# EAGLE design SmartHomeControllerCircuit (EAGLE 7.5.0)
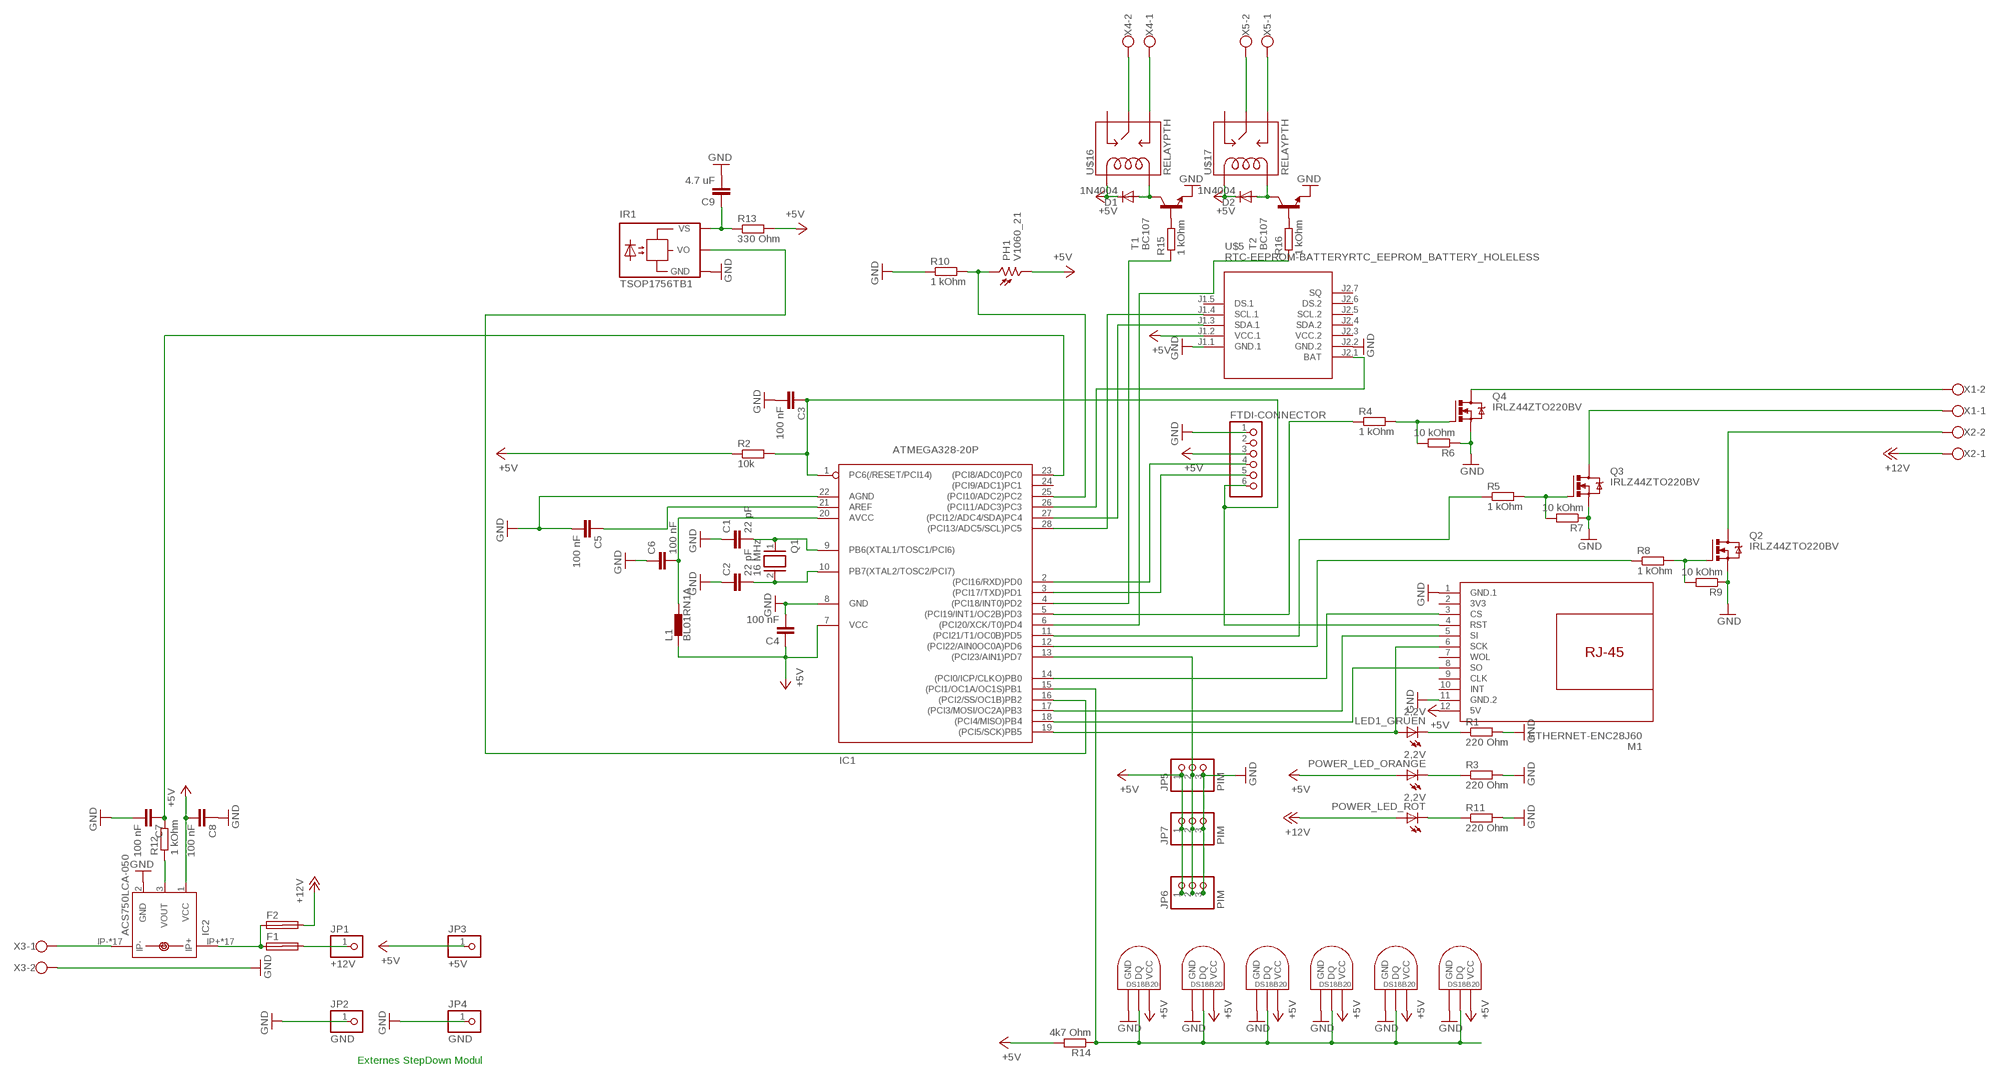
[diagram p0: schematic, sheet 1]

## Parts
C1  22 pF  C-EU050-024X044  [C050-024X044]
C2  22 pF  C-EU050-024X044  [C050-024X044]
C3  100 nF  C-EU050-024X044  [C050-024X044]
C4  100 nF  C-EU050-024X044  [C050-024X044]
C5  100 nF  C-EU050-024X044  [C050-024X044]
C6  100 nF  C-EU050-024X044  [C050-024X044]
C7  100 nF  C-EU050-024X044  [C050-024X044]
C8  100 nF  C-EU050-024X044  [C050-024X044]
C9  4.7 uF  C-EU050-024X044  [C050-024X044]
D1  1N4004  [DO41-10]
D2  1N4004  [DO41-10]
F1  SH32  [SH32]
F2  SH32  [SH32]
FTDI-CONNECTOR  PINHD-1X6  [1X06]
IC1  ATMEGA328-20P  [DIL28-3]
IC2  ACS750LCA-050  [ACS75050]
IR1  TSOP1756TB1  [TSOP17_TB1]
JP1  +12V  PINHD-1X1  [1X01]
JP2  GND  PINHD-1X1  [1X01]
JP3  +5V  PINHD-1X1  [1X01]
JP4  GND  PINHD-1X1  [1X01]
JP5  PIM  PINHD-1X3  [1X03]
JP6  PIM  PINHD-1X3  [1X03]
JP7  PIM  PINHD-1X3  [1X03]
L1  BL01RN1A  [BL01RN1A]
LED1_GRUEN  2,2V  LED5MM  [LED5MM]
M1  ETHERNET-ENC28J60  [ETHERNET-ENC28J60]
PH1  V1060_21  [TO-5_V10]
POWER_LED_ORANGE  2,2V  LED5MM  [LED5MM]
POWER_LED_ROT  2,2V  LED5MM  [LED5MM]
Q1  16 MHz  XTAL/S  [QS]
Q2  IRLZ44ZTO220BV  [TO220BV]
Q3  IRLZ44ZTO220BV  [TO220BV]
Q4  IRLZ44ZTO220BV  [TO220BV]
R1  220 Ohm  R-EU_0204/7  [0204/7]
R2  10k  R-EU_0204/7  [0204/7]
R3  220 Ohm  R-EU_0204/7  [0204/7]
R4  1 kOhm  R-EU_0309/12  [0309/12]
R5  1 kOhm  R-EU_0309/12  [0309/12]
R6  10 kOhm  R-EU_0309/12  [0309/12]
R7  10 kOhm  R-EU_0309/12  [0309/12]
R8  1 kOhm  R-EU_0309/12  [0309/12]
R9  10 kOhm  R-EU_0309/12  [0309/12]
R10  1 kOhm  R-EU_0309/12  [0309/12]
R11  220 Ohm  R-EU_0204/7  [0204/7]
R12  1 kOhm  R-EU_0204/7  [0204/7]
R13  330 Ohm  R-EU_0309/12  [0309/12]
R14  4k7 Ohm  R-EU_0204/7  [0204/7]
R15  1 kOhm  R-EU_0309/12  [0309/12]
R16  1 kOhm  R-EU_0309/12  [0309/12]
T1  BC107  [TO18]
T2  BC107  [TO18]
U$5  RTC-EEPROM-BATTERYRTC_EEPROM_BATTERY_HOLELESS  [RTC_EEPROM_BATTERY]
U$10  DS1820TO92  [DS1820]
U$11  DS1820TO92  [DS1820]
U$12  DS1820TO92  [DS1820]
U$13  DS1820TO92  [DS1820]
U$14  DS1820TO92  [DS1820]
U$15  DS1820TO92  [DS1820]
U$16  RELAYPTH  [SRD-05VDC-SL-C]
U$17  RELAYPTH  [SRD-05VDC-SL-C]
X1  W237-102  [W237-102]
X2  W237-102  [W237-102]
X3  W237-102  [W237-102]
X4  W237-102  [W237-102]
X5  W237-102  [W237-102]

## Nets
+5V: C4.1 C8.2 D1.C D2.C FTDI-CONNECTOR.3 IC1.7(VCC) IC2.1(VCC) JP3.1 JP5.1 JP6.1 JP7.1 L1.1 M1.12(5V) PH1.2 POWER_LED_ORANGE.A R2.1 R13.2 R14.2 U$5.J1.2(VCC.1) U$10.VDD(VCC) U$11.VDD(VCC) U$12.VDD(VCC) U$13.VDD(VCC) U$14.VDD(VCC) U$15.VDD(VCC) U$16.COIL1 U$17.COIL1
+12V: F2.2A POWER_LED_ROT.A X2.1
+12V_IN: F1.1A F2.1A IC2.IP+ IC2.IP+@2(IP+) IC2.IP+@3(IP+) IC2.IP+@4(IP+) IC2.IP+@5(IP+) IC2.IP+@6(IP+) IC2.IP+@7(IP+) IC2.IP+@8(IP+) IC2.IP+@9(IP+) IC2.IP+@10(IP+) IC2.IP+@11(IP+) IC2.IP+@12(IP+) IC2.IP+@13(IP+) IC2.IP+@14(IP+) IC2.IP+@15(IP+) IC2.IP+@16(IP+) IC2.IP+@17(IP+) IC2.IP- IC2.IP-@2(IP-) IC2.IP-@3(IP-) IC2.IP-@4(IP-) IC2.IP-@5(IP-) IC2.IP-@6(IP-) IC2.IP-@7(IP-) IC2.IP-@8(IP-) IC2.IP-@9(IP-) IC2.IP-@10(IP-) IC2.IP-@11(IP-) IC2.IP-@12(IP-) IC2.IP-@13(IP-) IC2.IP-@14(IP-) IC2.IP-@15(IP-) IC2.IP-@16(IP-) IC2.IP-@17(IP-) X3.1
GND: C1.1 C2.1 C3.2 C4.2 C5.2 C6.1 C7.2 C8.1 C9.2 FTDI-CONNECTOR.1 IC1.8(GND) IC1.22(AGND) IC2.2(GND) IR1.GND JP2.1 JP4.1 JP5.3 JP6.3 JP7.3 M1.1(GND.1) M1.11(GND.2) Q2.S Q3.S Q4.S R1.2 R3.2 R6.1 R7.1 R9.1 R10.1 R11.2 T1.1(E) T2.1(E) U$5.J1.1(GND.1) U$5.J2.2(GND.2) U$10.GND U$11.GND U$12.GND U$13.GND U$14.GND U$15.GND X3.2
N$1: C2.2 IC1.10(PB7(XTAL2/TOSC2/PCI7)) Q1.2
N$2: C1.2 IC1.9(PB6(XTAL1/TOSC1/PCI6)) Q1.1
N$3: C3.1 FTDI-CONNECTOR.6 IC1.1(PC6(/RESET/PCI14)) M1.4(RST) R2.2
N$4: FTDI-CONNECTOR.4 IC1.2((PCI16/RXD)PD0)
N$5: FTDI-CONNECTOR.5 IC1.3((PCI17/TXD)PD1)
N$7: IC1.19((PCI5/SCK)PB5) LED1_GRUEN.A M1.6(SCK)
N$8: LED1_GRUEN.K(C) R1.1
N$9: POWER_LED_ORANGE.K(C) R3.1
N$10: F1.2A JP1.1
N$12: IC1.25((PCI10/ADC2)PC2) PH1.1 R10.2
N$13: C9.1 IR1.VS R13.1
N$14: IC1.28((PCI13/ADC5/SCL)PC5) U$5.J1.4(SCL.1)
N$15: IC1.27((PCI12/ADC4/SDA)PC4) U$5.J1.3(SDA.1)
N$16: IC1.14((PCI0/ICP/CLKO)PB0) M1.3(CS)
N$17: IC1.18((PCI4/MISO)PB4) M1.8(SO)
N$18: IC1.17((PCI3/MOSI/OC2A)PB3) M1.5(SI)
N$19: Q2.D X2.2
N$20: Q2.G R8.2 R9.2
N$21: Q3.D X1.1
N$22: Q4.D X1.2
N$23: Q3.G R5.2 R7.2
N$24: Q4.G R4.2 R6.2
N$25: IC1.5((PCI19/INT1/OC2B)PD3) R4.1
N$26: IC1.11((PCI21/T1/OC0B)PD5) R5.1
N$27: IC1.15((PCI1/OC1A/OC1S)PB1) R14.1 U$10.DQ U$11.DQ U$12.DQ U$13.DQ U$14.DQ U$15.DQ
N$28: C7.1 IC1.23((PCI8/ADC0)PC0) R12.2
N$29: IC1.13((PCI23/AIN1)PD7) JP5.2 JP6.2 JP7.2
N$30: POWER_LED_ROT.K(C) R11.1
N$31: IC2.3(VOUT) R12.1
N$32: IC1.16((PCI2/SS/OC1B)PB2) IR1.VO
N$33: IC1.12((PCI22/AIN0OC0A)PD6) R8.1
N$34: U$16.SWCOMMON X4.2
N$35: IC1.26((PCI11/ADC3)PC3) U$5.J2.1(BAT)
N$36: U$16.SWOPEN X4.1
N$37: U$17.SWCOMMON X5.2
N$38: U$17.SWOPEN X5.1
N$39: IC1.4((PCI18/INT0)PD2) R15.1
N$40: IC1.6((PCI20/XCK/T0)PD4) R16.1
N$41: D1.A T1.3(C) U$16.COIL0
N$42: D2.A T2.3(C) U$17.COIL0
N$43: R15.2 T1.2(B)
N$44: R16.2 T2.2(B)
N$46: C5.1 IC1.21(AREF)
N$47: C6.2 IC1.20(AVCC) L1.2
Unconnected: F1.1B F1.2B F2.1B F2.2B FTDI-CONNECTOR.2 IC1.24((PCI9/ADC1)PC1) M1.7(WOL) M1.9(CLK) M1.10(INT) U$5.J1.5(DS.1) U$5.J2.4(SDA.2) U$5.J2.5(SCL.2) U$5.J2.6(DS.2) U$5.J2.7(SQ) U$16.SWCLOSED(SWCLOSE) U$17.SWCLOSED(SWCLOSE)

## Notes on the sheet
- Externes StepDown Modul

## Power pins joined to a net without a drawn wire
3V3: M1.2(3V3)
VCC.2: U$5.J2.3(VCC.2)

## Library data of the parts
C1-C9 = rcl:C-EU: CAPACITOR, European symbol
D1 D2 = diode:1N4004: DIODE general purpose rectifier, 1 A
F1 F2 = fuse:SH32: FUSE HOLDER 6 x 32 mm, SH contact, SHH3N Schukat, 102071 Wickmann (Buerklin); MPN: 10207101009; OC_FARNELL: 811786; OC_NEWARK: 76R6904
FTDI-CONNECTOR = pinhead:PINHD-1X6: PIN HEADER
IC1 = atmega328:ATMEGA328*P: MICROCONTROLLER 32 kBytes FLASH 2 kBytes SRAM 1 kBytes EEPROM USART 8-channel 10 bit ADC
IC2 = allegro:ACS750*CA-050: Current Sensor display layer 49 Reference in BRD and place VIAs on circles Source: www.allegromicro.com/datafile/0750-050.pdf; MF: ALLEGRO MICROSYSTEMS, INC.; MPN: ACS750LCA-050; OC_FARNELL: 1457176; OC_NEWARK: 61H4464
IR1 = telefunken:TSOP17*TB1: TSOP17..TB1 IR Receiver Modules for Remote Control Systems Source: http://www.vishay.com/docs/82042/82042.pdf; OC_FARNELL: unknown; OC_NEWARK: unknown
JP1-JP4 = pinhead:PINHD-1X1: PIN HEADER
JP5-JP7 = pinhead:PINHD-1X3: PIN HEADER
L1 = inductors:BL0: Noise Suppression Products/EMI Suppression Filters, Lead EMIFIL(R) Inductor Type Source: http://www.murata.com .. BL01RN1_DS.pdf
LED1_GRUEN POWER_LED_ORANGE POWER_LED_ROT = led:LED: LED OSRAM: - CHIPLED LG R971, LG N971, LY N971, LG Q971, LY Q971, LO R971, LY R971 LH N974, LH R974 LS Q976, LO Q976, LY Q976 LO Q996 - Hyper CHIPLED LW Q18S LB Q993, LB Q99A, LB R99A - SideLED LS A670, LO A670, LY A670, LG A670, LP A670 LB A673, LV A673, LT A673, LW A673 LH A674 LY A675 LS A676, LA A676, LO A676, LY A676, LW A676 LS A679, LY A679, LG A679 - Hyper Micro SIDELED® LS Y876, LA Y876, LO Y876, LY Y876 LT Y87S - SmartLED LW L88C, LW L88S LB L89C, LB L89S, LG L890 LS L89K, LO L89K, LY L89K LS L896, LA L896, LO L896, LY L896 - TOPLED LS T670, LO T670, LY T670, LG T670, LP T670 LSG T670, LSP T670, LSY T670, LOP T670, LYG T670 LG T671, LOG T671, LSG T671 LB T673, LV T673, LT T673, LW T673 LH T674 LS T676, LA T676, LO T676, LY T676, LB T676, LH T676, LSB T676, LW T676 LB T67C, LV T67C, LT T67C, LS T67K, LO T67K, LY T67K, LW E67C LS E67B, LA E67B, LO E67B, LY E67B, LB E67C, LV E67C, LT E67C LW T67C LS T679, LY T679, LG T679 LS T770, LO T770, LY T770, LG T770, LP T770 LB T773, LV T773, LT T773, LW T773 LH T774 LS E675, LA E675, LY E675, LS T675 LS T776, LA T776, LO T776, LY T776, LB T776 LHGB T686 LT T68C, LB T68C - Hyper Mini TOPLED® LB M676 - Mini TOPLED Santana® LG M470 LS M47K, LO M47K, LY M47K Source: http://www.osram.convergy.de LUXEON: - LUMILED® LXK2-PW12-R00, LXK2-PW12-S00, LXK2-PW14-U00, LXK2-PW14-V00 LXK2-PM12-R00, LXK2-PM12-S00, LXK2-PM14-U00 LXK2-PE12-Q00, LXK2-PE12-R00, LXK2-PE12-S00, LXK2-PE14-T00, LXK2-PE14-U00 LXK2-PB12-K00, LXK2-PB12-L00, LXK2-PB12-M00, LXK2-PB14-N00, LXK2-PB14-P00, LXK2-PB14-Q00 LXK2-PR12-L00, LXK2-PR12-M00, LXK2-PR14-Q00, LXK2-PR14-R00 LXK2-PD12-Q00, LXK2-PD12-R00, LXK2-PD12-S00 LXK2-PH12-R00, LXK2-PH12-S00 LXK2-PL12-P00, LXK2-PL12-Q00, LXK2-PL12-R00 Source: www.luxeon.com KINGBRIGHT: KA-3528ASYC Source: www.kingbright.com
M1 = diy-modules:ETHERNET-ENC28J60: Ethernet Module based on ENC28J60 chip
PH1 = photo-elements:?1060*: Sensor Street Light control Source: http://optoelectronics.perkinelmer.com/content/Datasheets/DTS_PhotocellsB1060.pdf
Q1 = special:XTAL/S: CRYSTAL
Q2-Q4 = transistor-power:IRLZ44Z: N-Channel HEXFET® Power MOSFET Logic Level AUTOMOTIVE MOSFET Source: http://www.irf.com/product-info/datasheets/data/irlz44zpbf.pdf
R1-R3 R11 R12 R14 = resistor:R-EU_: RESISTOR, European symbol
R4-R10 R13 R15 R16 = rcl:R-EU_: RESISTOR, European symbol
T1 T2 = transistor:BC107: NPN TRANSISTOR
U$5 = diy-modules:RTC-EEPROM-BATTERY: RTC Module with Battery and EEPROM based on DS1307 and AT24C32 chips
U$10-U$15 = Ava:DS1820: DS18B20 Programmable Resolution 1-Wire Digital Thermometer Description The DS18B20 digital thermometer provides 9-bit to 12-bit Celsius temperature measurements and has an alarm function with nonvolatile user-programmable upper and lower trigger points. The DS18B20 communicates over a 1-Wire® bus that by definition requires only one data line (and ground) for communication with a central microprocessor. It has an operating temperature range of -55°C to +125°C and is accurate to ±0.5°C over the range of -10°C to +85°C. In addition, the DS18B20 can derive power directly from the data line ("parasite power"), eliminating the need for an external power supply. Each DS18B20 has a unique 64-bit serial code, which allows multiple DS18B20s to function on the same 1-Wire bus. Thus, it is simple to use one microprocessor to control many DS18B20s distributed over a large area. Applications that can benefit from this feature include HVAC environmental controls, temperature monitoring systems inside buildings, equipment, or machinery, and process monitoring and control systems.
U$16 U$17 = SRD-05VDC-SL-C:RELAY: SPDT relay (COM-00101)
X1-X5 = con-wago-500:W237-102: WAGO SCREW CLAMP; MPN: 237-102; OC_FARNELL: unknown; OC_NEWARK: 70K9898

## Board
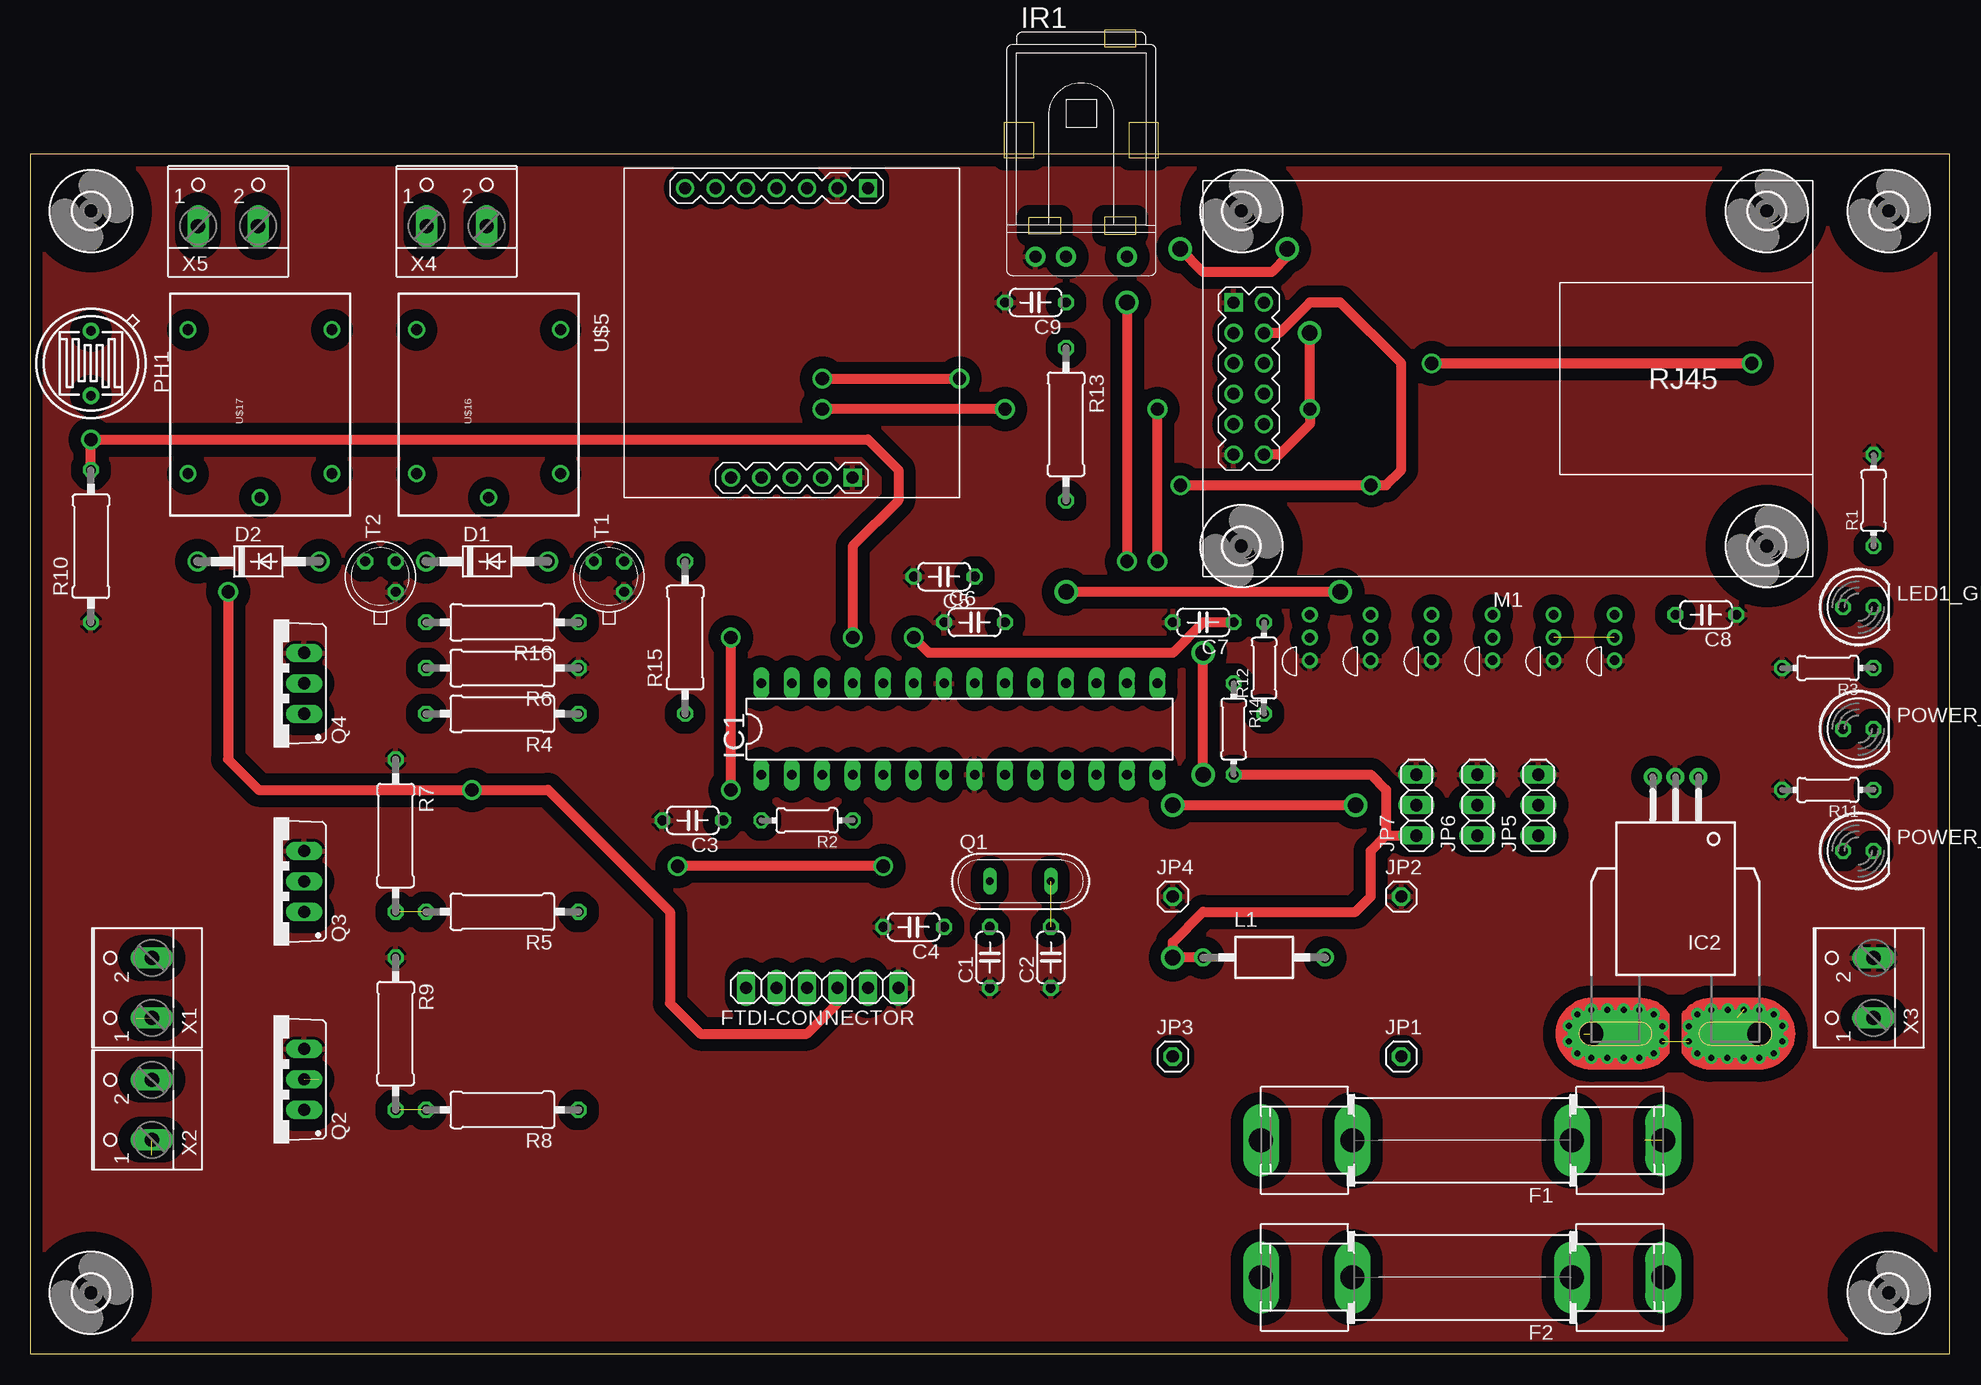
[diagram p1: board, top side]
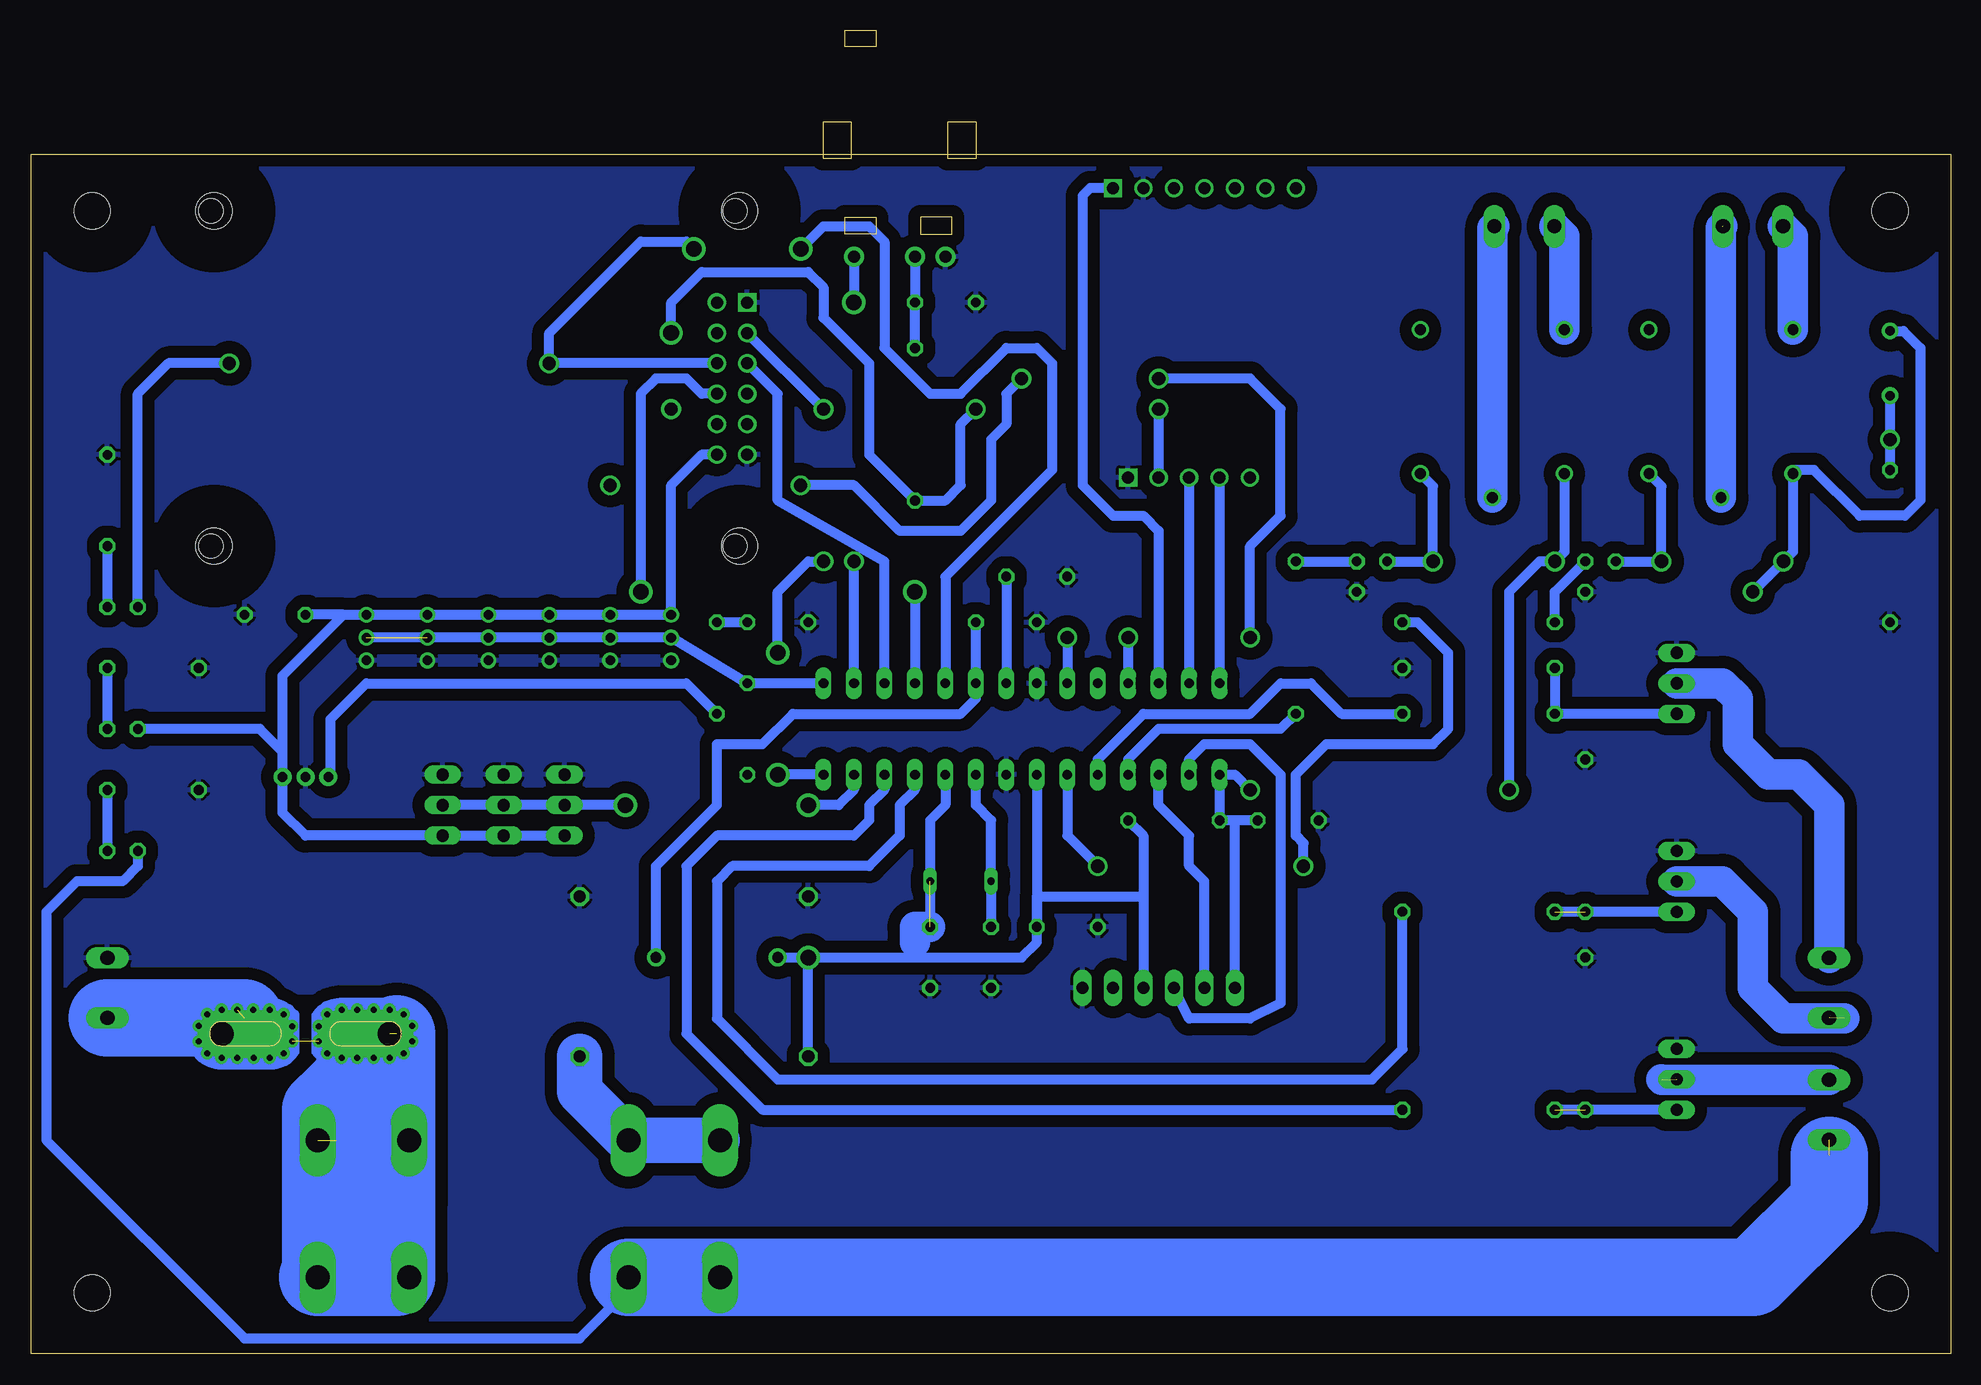
[diagram p2: board, bottom side, seen from below]

Size 160 x 100 mm. Coordinates in mm from the lower left corner, seen from the top.
Outline: 0,0 160,0 160,100 0,100 0,0
Copper layers (1*16): Top 0.035mm / dielectric 1.5mm / Bottom 0.035mm
Design rules "default": minimum track width 10mil, minimum drill 24mil, track to track 8mil, track to pad 8mil, pad to pad 8mil, via to via 8mil, smd to smd 8mil, copper to edge 40mil, drill to drill 8mil, minimum pad ring 10mil, minimum via ring 8mil, stop-mask expansion 4mil, vias tented up to drill 0mil, thermal gap 10mil

### Footprints (pad centres in the part's own frame; a part is rotated, then mirrored left to right if it is on the bottom)
C050-024X044 = drill 0.813 octagon: 1 -2.54,0; 2 2.54,0
DO41-10 = drill 1.118: A 5.08,0; C -5.08,0
SH32 = drill 2.007 long: 1A -16.764,0; 1B -9.144,0; 2A 9.144,0; 2B 16.764,0
1X06 = drill 1.016 long: 1 -6.35,0; 2 -3.81,0; 3 -1.27,0; 4 1.27,0; 5 3.81,0; 6 6.35,0
DIL28-3 = drill 0.813 long: 1 -16.51,-3.81; 2 -13.97,-3.81; 3 -11.43,-3.81; 4 -8.89,-3.81; 5 -6.35,-3.81; 6 -3.81,-3.81; 7 -1.27,-3.81; 8 1.27,-3.81; 9 3.81,-3.81; 10 6.35,-3.81; 11 8.89,-3.81; 12 11.43,-3.81; 13 13.97,-3.81; 14 16.51,-3.81; 15 16.51,3.81; 16 13.97,3.81; 17 11.43,3.81; 18 8.89,3.81; 19 6.35,3.81; 20 3.81,3.81; 21 1.27,3.81; 22 -1.27,3.81; 23 -3.81,3.81; 24 -6.35,3.81; 25 -8.89,3.81; 26 -11.43,3.81; 27 -13.97,3.81; 28 -16.51,3.81
ACS75050 = drill 0.8 pad 1.5: 1 -1.91,-21.4; 2 0,-21.4; 3 1.91,-21.4 | drill 2 pad 4 offset: IP+ 7,0; IP- -7,0 | drill 0.5 pad 0.9: IP+@2 8.89,-0.635; IP+@3 8.89,0.635; IP+@4 8.175,1.625; IP+@5 7,2; IP+@6 5.675,2; IP+@7 4.325,2; IP+@8 3,2; IP+@9 1.825,1.625; IP+@10 1.1,0.625; IP+@11 1.1,-0.625; IP+@12 1.825,-1.625; IP+@13 3,-2; IP+@14 4.325,-2; IP+@15 5.675,-2; IP+@16 7,-2; IP+@17 8.175,-1.625; IP-@2 -8.89,-0.635; IP-@3 -8.89,0.635; IP-@4 -8.175,1.625; IP-@5 -7,2; IP-@6 -5.675,2; IP-@7 -4.325,2; IP-@8 -3,2; IP-@9 -1.825,1.625; IP-@10 -1.1,0.625; IP-@11 -1.1,-0.625; IP-@12 -1.825,-1.625; IP-@13 -3,-2; IP-@14 -4.35,-2; IP-@15 -5.675,-2; IP-@16 -7,-2; IP-@17 -8.175,-1.625
TSOP17_TB1 = drill 1 pad 1.676: GND 0,-3.81; VO 0,3.81; VS 0,-1.27
1X01 = drill 1.016 octagon: 1 0,0
1X03 = drill 1.016 long: 1 -2.54,0; 2 0,0; 3 2.54,0
BL01RN1A = drill 0.9 pad 1.5: 1 -5.08,0; 2 5.08,0
LED5MM = drill 0.813 octagon: A -1.27,0; K 1.27,0
ETHERNET-ENC28J60 = drill 1 square: 1 22.86,-6.35 | drill 1: 2 20.32,-6.35; 3 22.86,-3.81; 4 20.32,-3.81; 5 22.86,-1.27; 6 20.32,-1.27; 7 22.86,1.27; 8 20.32,1.27; 9 22.86,3.81; 10 20.32,3.81; 11 22.86,6.35; 12 20.32,6.35 | hole 2: -21.844,13.97; 21.844,13.97; -21.844,-13.97; 21.844,-13.97
TO-5_V10 = drill 0.8 pad 1.4: 1 -2.7,0; 2 2.7,0
QS = drill 0.61 long: 1 -2.54,0; 2 2.54,0
TO220BV = drill 1.016 long: D 0,-2.54; G -2.54,-2.54; S 2.54,-2.54
0204/7 = drill 0.813 octagon: 1 -3.81,0; 2 3.81,0
0309/12 = drill 0.813 octagon: 1 -6.35,0; 2 6.35,0
TO18 = drill 0.813 octagon: 1 -1.27,-1.27; 2 1.27,-1.27; 3 1.27,1.27
3,0 = hole 3: 0,0
RTC_EEPROM_BATTERY = drill 1 square: J1.1 -12.065,-5.08; J2.1 12.065,-6.35 | drill 1: J1.2 -12.065,-2.54; J1.3 -12.065,0; J1.4 -12.065,2.54; J1.5 -12.065,5.08; J2.2 12.065,-3.81; J2.3 12.065,-1.27; J2.4 12.065,1.27; J2.5 12.065,3.81; J2.6 12.065,6.35; J2.7 12.065,8.89
DS1820 = drill 0.8: DQ 2.54,-1.27; GND 0.635,-1.27; VDD 4.445,-1.27
SRD-05VDC-SL-C = drill 0.9: COIL0 -5.39,-6.12; COIL1 -5.39,5.88; SWCLOSED 6.61,-6.12; SWCOMMON -7.39,-0.12; SWOPEN 6.61,5.88
W237-102 = drill 1.194 long: 1 -2.5,-1.27; 2 2.5,-1.27

### Placement (x,y rotation side)
C1  80.01,33.02 90 top
C2  85.09,33.02 90 top
C3  55.24,44.45 180 top
C4  73.66,35.56 180 top
C5  76.2,64.77 180 top
C6  78.74,60.96 0 top
C7  97.79,60.96 180 top
C8  139.7,61.59 180 top
C9  83.82,87.63 180 top
D1  38.1,66.04 0 top
D2  19.05,66.04 0 top
F1  119.38,17.78 180 top
F2  119.38,6.35 180 top
FTDI-CONNECTOR  66.04,30.48 180 top
IC1  77.47,52.07 0 top
IC2  137.16,26.67 180 top
IR1  87.63,91.44 270 top
JP1  114.3,24.77 0 top
JP2  114.3,38.1 0 top
JP3  95.25,24.77 0 top
JP4  95.25,38.1 0 top
JP5  125.73,45.72 90 top
JP6  120.65,45.72 90 top
JP7  115.57,45.72 90 top
L1  102.87,33.02 0 top
LED1_GRUEN  152.4,62.23 0 top
M1  123.19,81.28 180 top
PH1  5.08,82.55 90 top
POWER_LED_ORANGE  152.4,52.07 0 top
POWER_LED_ROT  152.4,41.91 0 top
Q1  82.55,39.37 0 top
Q2  20.32,22.86 90 top
Q3  20.32,39.37 90 top
Q4  20.32,55.88 90 top
R1  153.67,71.12 90 top
R2  64.77,44.45 180 top
R3  149.86,57.15 180 top
R4  39.37,53.34 180 top
R5  39.37,36.83 180 top
R6  39.37,57.15 180 top
R7  30.48,43.18 270 top
R8  39.37,20.32 180 top
R9  30.48,26.67 270 top
R10  5.08,67.31 90 top
R11  149.86,46.99 180 top
R12  102.87,57.15 90 top
R13  86.36,77.47 270 top
R14  100.33,52.07 270 top
R15  54.61,59.69 90 top
R16  39.37,60.96 180 top
T1  48.26,64.77 90 top
T2  29.21,64.77 90 top
U$1  [3,0]  5.08,5.08 0 top
U$2  [3,0]  5.08,95.25 0 top
U$3  [3,0]  154.94,95.25 0 top
U$4  [3,0]  154.94,5.08 0 top
U$5  63.5,85.09 90 top
U$6  [3,0]  144.78,67.31 0 top
U$7  [3,0]  144.78,95.25 0 top
U$8  [3,0]  100.97,95.25 0 top
U$9  [3,0]  100.97,67.31 0 top
U$10  105.41,57.15 90 top
U$11  110.49,57.15 90 top
U$12  115.57,57.15 90 top
U$13  120.65,57.15 90 top
U$14  125.73,57.15 90 top
U$15  130.81,57.15 90 top
U$16  38.1,78.74 90 top
U$17  19.05,78.74 90 top
X1  8.89,30.48 90 top
X2  8.89,20.32 90 top
X3  152.4,30.48 90 top
X4  35.56,95.25 0 top
X5  16.51,95.25 0 top

### Tracks (layer width: path | path; a pad name or v marks a point on that pad's centre or on a via)
+5V  (via drill 1.1, 1.3)
  Top 0.813: v16.51,63.5 16.51,49.53 19.05,46.99 v36.83,46.99 43.18,46.99 53.34,36.83 53.34,29.21 55.88,26.67 64.77,26.67 67.31,29.21 FTDI-CONNECTOR.3 | v81.28,78.74 v66.04,78.74 | v106.68,85.09 v106.68,78.74 106.68,77.47 104.14,74.93 M1.12 | L1.1 v95.25,33.02 95.25,34.29 97.79,36.83 110.49,36.83 111.76,38.1 111.76,41.91 113.03,43.18 | 113.03,43.18 JP7.1 | R14.2 111.76,48.26 113.03,46.99 113.03,43.18
  Bottom 0.813: R2.1 67.31,43.18 67.31,38.1 | 67.31,38.1 FTDI-CONNECTOR.3 | JP3.1 v95.25,33.02 | v95.25,33.02 77.47,33.02 76.2,34.29 C4.1 | IC1.7 C4.1 | C4.1 76.2,38.1 67.31,38.1 | IC2.1 139.07,56.51 133.99,61.59 | 133.99,61.59 U$15.VDD U$14.VDD U$13.VDD U$12.VDD U$11.VDD U$10.VDD 106.68,72.39 104.14,74.93 M1.12 | L1.1 v95.25,33.02 | 133.99,61.59 C8.2 | IC2.1 139.06,45.09 137.16,43.18 JP5.1 JP6.1 JP7.1 | IC2.1 139.07,50.17 140.97,52.07 POWER_LED_ORANGE.A | U$16.COIL1 32.22,66.84 D1.C 34.29,66.04 36.83,63.5 v36.83,46.99 | v16.51,63.5 D2.C 13.17,66.84 U$17.COIL1 12.86,73.66 11.43,73.66 7.62,69.85 3.81,69.85 2.54,71.12 2.54,83.82 3.97,85.25 PH1.2 | v81.28,78.74 82.55,77.47 82.55,72.39 83.82,71.12 R13.2 90.17,74.93 90.17,82.55 93.98,86.36 93.98,88.9 95.25,90.17 104.14,90.17 106.68,87.63 v106.68,85.09 | v66.04,78.74 U$5.J1.2
+12V  (1 unrouted)
  Bottom 0.813: POWER_LED_ROT.A 151.13,40.64 152.4,39.37 156.21,39.37 158.75,36.83 158.75,17.78 142.24,1.27 114.3,1.27 109.22,6.35
  Bottom 6.452: F2.2A 109.22,6.35 16.51,6.35 10.16,12.7 10.16,16.51
+12V_IN  (4 unrouted)
  Bottom 6.452: X3.1 142.28,27.98 142.24,27.94 | F2.1A 135.89,6.35 | 135.89,6.35 129.54,6.35 129.54,12.7 | 129.54,12.7 134.62,17.78 134.62,21.59 | 134.62,21.59 133.35,22.86 129.54,26.67 129.54,12.7 | 129.54,12.7 135.89,6.35 | 135.89,6.35 135.89,20.32 134.62,21.59
GND
  pour Bottom (isolate 1.016): 0,100.33 160.02,100.33 160.02,0 0,0
  pour Top (isolate 1.016): 0,100.33 160.02,100.33 160.02,0 0,0
N$1  (1 unrouted)
  Bottom 0.813: IC1.10 83.82,45.72 85.09,44.45 C2.2
  Bottom 2.54: C2.2 86.36,35.56 86.36,34.29
N$2
  Bottom 0.813: IC1.9 81.28,45.72 80.01,44.45 Q1.1 C1.2
N$3  (via drill 1.1)
  Top 0.813: v58.42,46.99 v58.42,59.69 | v66.04,81.28 v77.47,81.28 | v95.89,72.39 v111.76,72.39 113.03,72.39 114.3,73.66 114.3,82.55 109.22,87.63 106.68,87.63 104.14,85.09 M1.4
  Bottom 0.813: C3.1 59.69,44.45 | 59.69,44.45 R2.2 IC1.1 59.69,48.26 v58.42,46.99 | FTDI-CONNECTOR.6 59.69,44.45 | v58.42,59.69 58.42,67.31 55.88,69.85 55.88,78.74 58.42,81.28 v66.04,81.28 | v77.47,81.28 78.74,80.01 78.74,77.47 80.01,76.2 80.01,71.12 82.55,68.58 87.63,68.58 91.44,72.39 v95.89,72.39
N$4
  Bottom 0.813: FTDI-CONNECTOR.4 63.5,27.94 58.42,27.94 55.88,29.21 55.88,48.26 58.42,50.8 62.23,50.8 63.5,49.53 IC1.2
N$5
  Bottom 0.813: FTDI-CONNECTOR.5 62.23,39.37 63.5,40.64 63.5,43.18 66.04,45.72 IC1.3
N$6
  pour Bottom: 0,59.69 0,41.91 2.54,41.91 6.35,45.72 6.35,55.88 2.54,59.69
N$7  (via drill 1.1, 1.3)
  Top 0.813: v116.84,82.55 v143.51,82.55 | v104.78,92.08 104.78,91.44 103.5,90.17 97.79,90.17 v95.89,92.08
  Bottom 0.813: LED1_GRUEN.A 151.13,80.01 148.59,82.55 v143.51,82.55 | M1.6 v116.84,82.55 116.84,85.09 109.22,92.71 105.41,92.71 v104.78,92.08 | v95.89,92.08 93.98,93.98 90.17,93.98 88.9,92.71 88.9,83.82 85.09,80.01 82.55,80.01 78.74,83.82 76.2,83.82 74.93,82.55 74.93,73.66 83.82,64.77 IC1.19
N$8
  Bottom 0.813: R1.1 LED1_GRUEN.K
N$9
  Bottom 0.813: R3.1 POWER_LED_ORANGE.K
N$10
  Bottom 3.81: JP1.1 114.3,21.84 F1.2A 102.87,17.78
N$12  (via drill 1.1)
  Top 0.813: R10.2 v5.08,76.2 69.85,76.2 72.39,73.66 72.39,71.12 68.58,67.31 v68.58,59.69
  Bottom 0.813: PH1.1 v5.08,76.2 R10.2 | v68.58,59.69 IC1.25
N$13
  Bottom 0.813: IR1.VS C9.1 R13.1
N$14
  Bottom 0.813: U$5.J1.4 IC1.28
N$15
  Bottom 0.813: U$5.J1.3 IC1.27
N$16  (via drill 1.1, 1.3)
  Top 0.813: v97.79,48.26 v97.79,58.42 | v93.98,66.04 v93.98,78.74
  Bottom 0.813: IC1.14 v97.79,48.26 | v97.79,58.42 97.79,63.5 95.25,66.04 v93.98,66.04 | v93.98,78.74 M1.3
N$17  (via drill 1.1, 1.3)
  Top 0.813: v109.22,63.5 v86.36,63.5
  Bottom 0.813: M1.8 104.14,80.01 105.41,81.28 107.95,81.28 109.22,80.01 v109.22,63.5 | v86.36,63.5 IC1.18
N$18
  Bottom 0.813: IC1.17 88.9,66.04 97.79,71.12 97.79,80.01 M1.5
N$19  (1 unrouted)
  Bottom 2.54: X2.2 24.09,22.82 24.13,22.86
N$20  (1 unrouted)
  Bottom 0.813: Q2.G R8.2
N$21  (1 unrouted)
  Bottom 2.54: Q3.D 19.05,39.37 16.51,36.83 16.51,30.48 13.97,27.94 8.89,27.94
N$22
  Bottom 2.54: Q4.D 19.05,55.88 17.78,54.61 17.78,50.8 15.24,48.26 12.7,48.26 10.16,45.72 X1.2
N$23  (1 unrouted)
  Bottom 0.813: Q3.G R5.2
N$24
  Bottom 0.813: Q4.G R4.2 R6.2
N$25
  Bottom 0.813: IC1.5 71.12,49.53 67.31,53.34 58.42,53.34 55.88,55.88 53.34,55.88 50.8,53.34 R4.1
N$26
  Bottom 0.813: IC1.11 86.36,46.99 87.63,45.72 87.63,43.18 90.17,40.64 101.6,40.64 102.87,39.37 102.87,27.94 97.79,22.86 48.26,22.86 45.72,25.4 R5.1
N$27  (1 unrouted)
  Bottom 0.813: IC1.15 R14.1 U$10.DQ U$11.DQ U$12.DQ U$13.DQ U$15.DQ
N$28  (via drill 1.1)
  Top 0.813: C7.1 97.79,60.96 95.25,58.42 74.93,58.42 v73.66,59.69
  Bottom 0.813: C7.1 R12.2 | v73.66,59.69 IC1.23
N$29  (via drill 1.1, 1.3)
  Top 0.813: v95.25,45.72 v110.49,45.72
  Bottom 0.813: IC1.13 91.44,46.99 92.71,45.72 v95.25,45.72 | v110.49,45.72 JP7.2 JP6.2 JP5.2
N$30
  Bottom 0.813: R11.1 POWER_LED_ROT.K
N$31
  Bottom 0.813: IC2.3 135.06,48.26 135.06,52.9 132.08,55.88 105.41,55.88 R12.1
N$32  (via drill 1.1, 1.3)
  Top 0.813: v91.44,87.63 v91.44,66.04
  Bottom 0.813: IR1.VO v91.44,87.63 | IC1.16 v91.44,66.04
N$33
  Bottom 0.813: IC1.12 88.9,46.99 90.17,45.72 90.17,44.45 91.44,43.18 102.87,43.18 105.41,40.64 105.41,26.67 99.06,20.32 R8.1
N$34
  Bottom 2.54: U$16.SWCOMMON 38.22,93.82 X4.2
N$35
  Bottom 0.813: U$5.J2.1 71.75,97.16 72.39,96.52 72.39,72.39 69.85,69.85 67.31,69.85 66.04,68.58 IC1.26
N$36
  Bottom 2.54: U$16.SWOPEN 32.22,93.14 X4.1
N$37  (1 unrouted)
  Bottom 2.54: U$17.SWCOMMON 19.17,93.86 19.05,93.98
N$38
  Bottom 2.54: U$17.SWOPEN 13.17,93.14 X5.1
N$39
  Bottom 0.813: R15.1 55.88,52.07 66.04,52.07 68.58,49.53 IC1.4
N$40  (via drill 1.1)
  Top 0.813: v71.12,40.64 v53.98,40.64
  Bottom 0.813: IC1.6 73.66,43.18 v71.12,40.64 | v53.98,40.64 53.98,42.55 54.61,43.18 54.61,48.26 52.07,50.8 43.18,50.8 41.91,52.07 41.91,58.42 44.45,60.96 R16.1
N$41
  Bottom 0.813: U$16.COIL0 43.18,72.31 D1.A T1.3
N$42
  Bottom 0.813: U$17.COIL0 24.13,72.31 D2.A T2.3
N$43
  Bottom 0.813: R15.2 T1.2
N$44
  Bottom 0.813: R16.2 33.02,63.5 T2.2
N$46
  Bottom 0.813: C5.1 IC1.21
N$47
  Bottom 0.813: C6.2 IC1.20 81.28,54.61 82.55,53.34 96.52,53.34 99.06,50.8 102.87,50.8 102.87,45.72 107.95,40.64 L1.2